# EAGLE design MCUio_v1.0 (EAGLE 9.3.0)
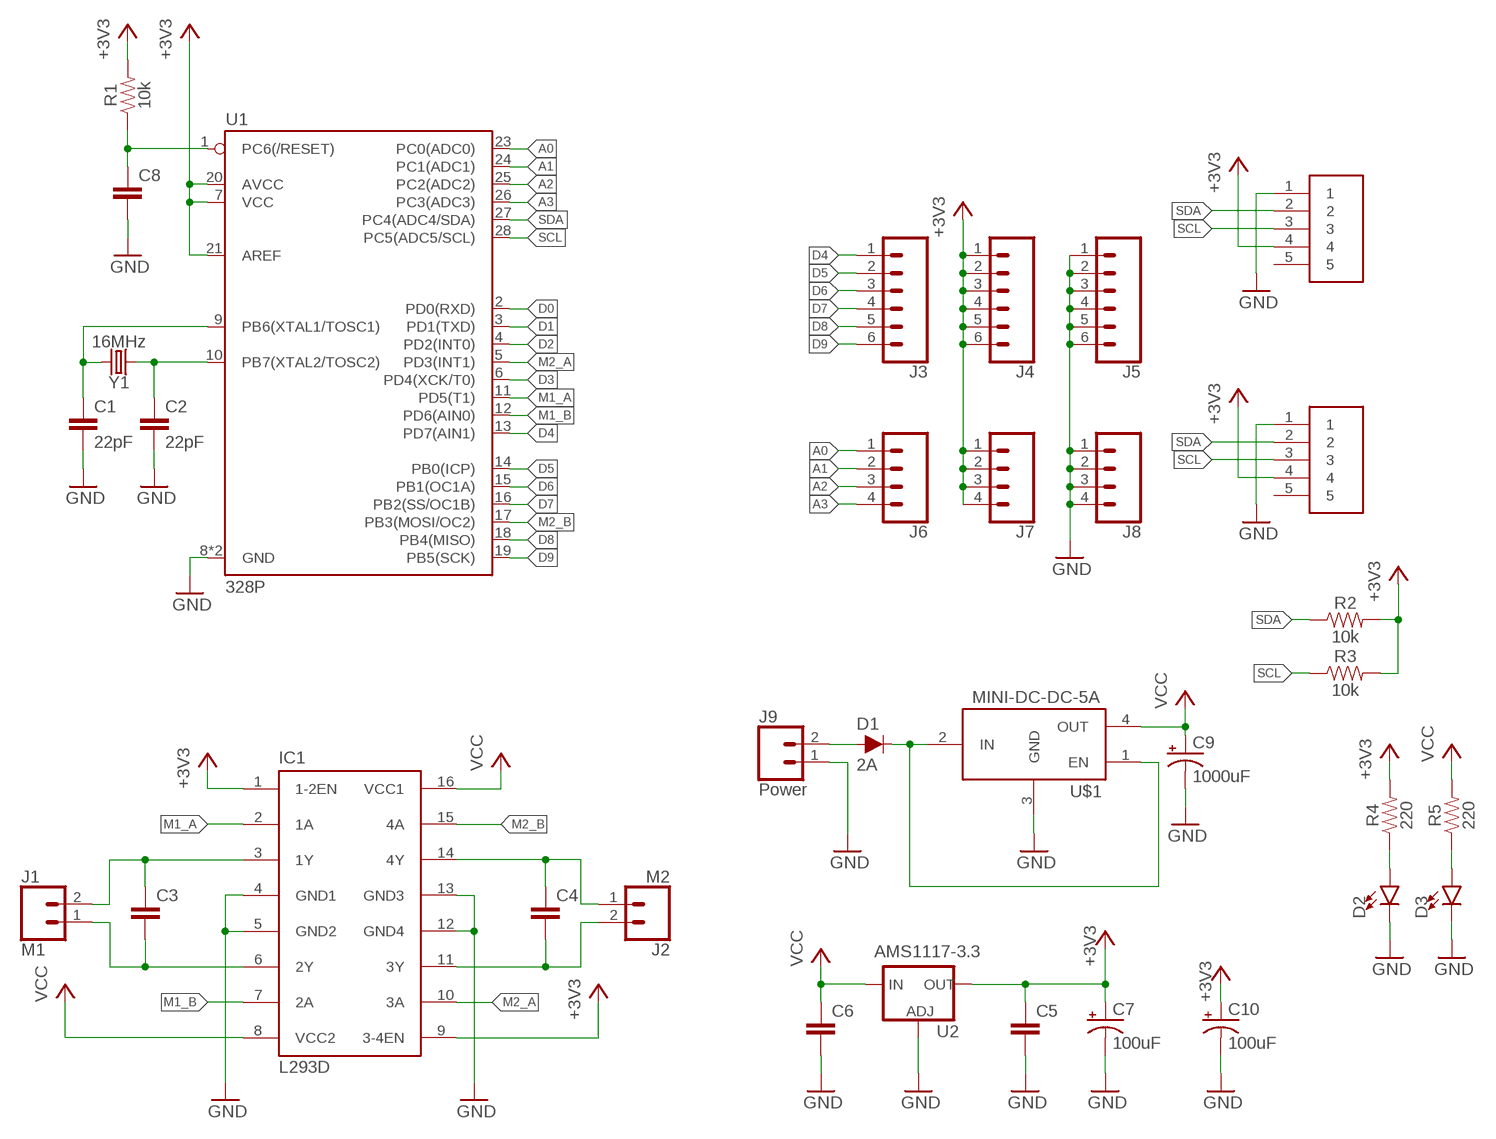
[diagram p0: schematic, sheet 1]

## Parts
C1  22pF  22PF-PTH-2.54MM-200V-5%  [CAP-PTH-2.54]
C2  22pF  22PF-PTH-2.54MM-200V-5%  [CAP-PTH-2.54]
C3  0.1uF  C5/2.5  [C5B2.5]
C4  0.1uF  C5/2.5  [C5B2.5]
C5  0.1uF  C5/2.5  [C5B2.5]
C6  0.1uF  C5/2.5  [C5B2.5]
C7  100uF  100UF-POLAR-RADIAL-2.5MM-25V-20%  [CPOL-RADIAL-2.5MM-6.5MM]
C8  0.1uF  C5/2.5  [C5B2.5]
C9  1000uF  1000UF-RADIAL-5MM-25V-20%  [CPOL-RADIAL-5MM-10MM]
C10  100uF  100UF-POLAR-RADIAL-2.5MM-25V-20%  [CPOL-RADIAL-2.5MM-6.5MM]
D1  2A  DIODE-KIT2  [DIODE-1N4001-KIT]
D2  LED3MM  [LED_3MM]
D3  LED3MM  [LED_3MM]
IC1  L293D  [DIL16]
J1  M1  CONN_025MM  [SCREWTERMINAL-5MM-2]
J2  M2  CONN_025MM  [SCREWTERMINAL-5MM-2]
J3  CONN_06SILK_FEMALE_PTH  [1X06]
J4  CONN_06SILK_FEMALE_PTH  [1X06]
J5  CONN_06SILK_FEMALE_PTH  [1X06]
J6  CONN_04PTH  [1X04]
J7  CONN_04PTH  [1X04]
J8  CONN_04PTH  [1X04]
J9  Power  CONN_025MM  [SCREWTERMINAL-5MM-2]
R1  10k  10KOHM-HORIZ-1/4W-5%  [AXIAL-0.3]
R2  10k  10KOHM-HORIZ-1/4W-5%  [AXIAL-0.3]
R3  10k  10KOHM-HORIZ-1/4W-5%  [AXIAL-0.3]
R4  220  220OHM-0603-1/10W-1%  [0603]
R5  220  220OHM-0603-1/10W-1%  [0603]
U1  328P  ATMEGA328P_PDIP  [DIP28]
U2  AMS1117-3.3  V_REG_LM1117SOT223  [SOT223]
U$1  MINI-DC-DC-5A  [MINI-DC-DC-3A]
U$2  JST5PIN  [JST5PIN]
U$3  JST5PIN  [JST5PIN]
Y1  16MHz  CRYSTAL-16MHZPTH-HC49US  [HC49US]

## Nets
+3V3: C5.1 C7.1(+) C10.1(+) IC1.1(1-2EN) IC1.9(3-4EN) J4.1 J4.2 J4.3 J4.4 J4.5 J4.6 J7.1 J7.2 J7.3 J7.4 R1.P$2 R2.P$2 R3.P$2 R4.2 U1.7(VCC) U1.20(AVCC) U1.21(AREF) U2.2(OUT) U2.4(OUT) U$2.4 U$3.4
A0: J6.1 U1.23(PC0(ADC0))
A1: J6.2 U1.24(PC1(ADC1))
A2: J6.3 U1.25(PC2(ADC2))
A3: J6.4 U1.26(PC3(ADC3))
D0: U1.2(PD0(RXD))
D1: U1.3(PD1(TXD))
D2: U1.4(PD2(INT0))
D3: U1.6(PD4(XCK/T0))
D4: J3.1 U1.13(PD7(AIN1))
D5: J3.2 U1.14(PB0(ICP))
D6: J3.3 U1.15(PB1(OC1A))
D7: J3.4 U1.16(PB2(SS/OC1B))
D8: J3.5 U1.18(PB4(MISO))
D9: J3.6 U1.19(PB5(SCK))
GND: C1.2 C2.2 C5.2 C6.2 C7.2(-) C8.2 C9.- C10.2(-) D2.K(C) D3.K(C) IC1.4(GND1) IC1.5(GND2) IC1.12(GND4) IC1.13(GND3) J5.1 J5.2 J5.3 J5.4 J5.5 J5.6 J8.1 J8.2 J8.3 J8.4 J9.1 U1.8(GND) U1.22(GND) U2.1(ADJ) U$1.3(GND) U$2.1 U$3.1
M1_A: IC1.2(1A) U1.11(PD5(T1))
M1_B: IC1.7(2A) U1.12(PD6(AIN0))
M2_A: IC1.10(3A) U1.5(PD3(INT1))
M2_B: IC1.15(4A) U1.17(PB3(MOSI/OC2))
N$1: C1.1 U1.9(PB6(XTAL1/TOSC1)) Y1.2
N$2: C2.1 U1.10(PB7(XTAL2/TOSC2)) Y1.1
N$3: C8.1 R1.P$1 U1.1(PC6(/RESET))
N$4: D1.A J9.2
N$5: D1.C U$1.1(EN) U$1.2(IN)
N$6: D2.A R4.1
N$7: D3.A R5.1
N$10: C3.1 IC1.3(1Y) J1.2
N$11: C3.2 IC1.6(2Y) J1.1
N$12: C4.1 IC1.14(4Y) J2.1
N$13: C4.2 IC1.11(3Y) J2.2
SCL: R3.P$1 U1.28(PC5(ADC5/SCL)) U$2.3 U$3.3
SDA: R2.P$1 U1.27(PC4(ADC4/SDA)) U$2.2 U$3.2
VCC: C6.1 C9.+ IC1.8(VCC2) IC1.16(VCC1) R5.2 U2.3(IN) U$1.4(OUT)
Unconnected: U$2.5 U$3.5

## Library data of the parts
C1 C2 = SparkFun-Capacitors:22PF: 22pF ceramic capacitors A capacitor is a passive two-terminal electrical component used to store electrical energy temporarily in an electric field.; PROD_ID: CAP-09128
C3-C6 C8 = capacitor-wima:C: CAPACITOR naming: grid - package width
C7 C10 = SparkFun-Capacitors:100UF-POLAR: 100µF polarized capacitors A capacitor is a passive two-terminal electrical component used to store electrical energy temporarily in an electric field.; PROD_ID: CAP-08439
C9 = SparkFun-Capacitors:1000UF: 1,000µF/1mF ceramic capacitors A capacitor is a passive two-terminal electrical component used to store electrical energy temporarily in an electric field. CAP-08070; PROD_ID: CAP-09538; VALUE: 1mF
D1 = SparkFun-DiscreteSemi:DIODE: Diode These are standard reverse protection diodes and small signal diodes. SparkFun Products: SparkFun SparkPunk Sound Kit <https://www.sparkfun.com/products/11177> SparkFun ESP8266 Thing <https://www.sparkfun.com/products/13231>; PROD_ID: DIO-09176; VALUE: 1A/50V/1.1V
D2 D3 = SparkFun-LED:LED: LED (Generic) Standard schematic elements and footprints for 5mm, 3mm, 1206, and 0603 sized LEDs. Generic LEDs with no color specified.; PROD_ID: DIO-08794
IC1 = st-microelectronics:L293D: PUSH-PULL 4 CHANNEL DRIVER; MPN: L293D; OC_FARNELL: 9589619; OC_NEWARK: 56P8249
J1 J2 J9 = SparkFun-Connectors:CONN_02: Multi connection point. Often used as Generic Header-pin footprint for 0.1 inch spaced/style header connections On any of the 0.1 inch spaced packages, you can populate with these: Break Away Headers - Straight <https://www.sparkfun.com/products/116> (PRT-00116) Break Away Male Headers - Right Angle <https://www.sparkfun.com/products/553> (PRT-00553) Female Headers <https://www.sparkfun.com/products/115> (PRT-00115) Break Away Headers - Machine Pin <https://www.sparkfun.com/products/117> (PRT-00117) Break Away Female Headers - Swiss Machine Pin <https://www.sparkfun.com/products/743> (PRT-00743) For SCREWTERMINALS and SPRING TERMINALS visit here: Screw Terimnals on SparkFun.com <https://www.sparkfun.com/search/results?term=Screw+Terminals> (5mm/3.5mm/2.54mm spacing) This device is also useful as a general connection point to wire up your design to another part of your project. Our various solder wires solder well into these plated through hole pads. Hook-Up Wire - Assortment (Stranded, 22 AWG) <https://www.sparkfun.com/products/11375> (PRT-11375) Hook-Up Wire - Assortment (Solid Core, 22 AWG) <https://www.sparkfun.com/products/11367> (PRT-11367) View the entire wire category on our website here <https://www.sparkfun.com/categories/141> Special notes: Molex polarized connector foot print use with: PRT-08233 with associated crimp pins and housings. 2.54_SCREWTERM for use with PRT-10571. 3.5mm Screw Terminal footprints for PRT-08084 5mm Screw Terminal footprints for use with PRT-08432; SF_SKU: PRT-08432
J3-J5 = SparkFun-Connectors:CONN_06: Multi connection point. Often used as Generic Header-pin footprint for 0.1 inch spaced/style header connections On any of the 0.1 inch spaced packages, you can populate with these: Break Away Headers - Straight <https://www.sparkfun.com/products/116> (PRT-00116) Break Away Male Headers - Right Angle <https://www.sparkfun.com/products/553> (PRT-00553) Female Headers <https://www.sparkfun.com/products/115> (PRT-00115) Break Away Headers - Machine Pin <https://www.sparkfun.com/products/117> (PRT-00117) Break Away Female Headers - Swiss Machine Pin <https://www.sparkfun.com/products/743> (PRT-00743) Arduino Stackable Header - 6 Pin <https://www.sparkfun.com/products/9280> (PRT-09280) For SCREWTERMINALS and SPRING TERMINALS visit here: Screw Terimnals on SparkFun.com <https://www.sparkfun.com/search/results?term=Screw+Terminals> (5mm/3.5mm/2.54mm spacing) This device is also useful as a general connection point to wire up your design to another part of your project. Our various solder wires solder well into these plated through hole pads. Hook-Up Wire - Assortment (Stranded, 22 AWG) <https://www.sparkfun.com/products/11375> (PRT-11375) Hook-Up Wire - Assortment (Solid Core, 22 AWG) <https://www.sparkfun.com/products/11367> (PRT-11367) View the entire wire category on our website here <https://www.sparkfun.com/categories/141>; PROD_ID: CONN-08437
J6-J8 = SparkFun-Connectors:CONN_04: Multi connection point. Often used as Generic Header-pin footprint for 0.1 inch spaced/style header connections On any of the 0.1 inch spaced packages, you can populate with these: Break Away Headers - Straight <https://www.sparkfun.com/products/116> (PRT-00116) Break Away Male Headers - Right Angle <https://www.sparkfun.com/products/553> (PRT-00553) Female Headers <https://www.sparkfun.com/products/115> (PRT-00115) Break Away Headers - Machine Pin <https://www.sparkfun.com/products/117> (PRT-00117) Break Away Female Headers - Swiss Machine Pin <https://www.sparkfun.com/products/743> (PRT-00743) For SCREWTERMINALS and SPRING TERMINALS visit here: Screw Terimnals on SparkFun.com <https://www.sparkfun.com/search/results?term=Screw+Terminals> (5mm/3.5mm/2.54mm spacing) This device is also useful as a general connection point to wire up your design to another part of your project. Our various solder wires solder well into these plated through hole pads. Hook-Up Wire - Assortment (Stranded, 22 AWG) <https://www.sparkfun.com/products/11375> (PRT-11375) Hook-Up Wire - Assortment (Solid Core, 22 AWG) <https://www.sparkfun.com/products/11367> (PRT-11367) View the entire wire category on our website here <https://www.sparkfun.com/categories/141> Special notes: Molex polarized connector foot print use with SKU : PRT-08231 with associated crimp pins and housings. 1MM SMD Version SKU: PRT-10208; PROD_ID: CONN-09696
R1-R3 = SparkFun-Resistors:10KOHM: 10kΩ resistor A resistor is a passive two-terminal electrical component that implements electrical resistance as a circuit element. Resistors act to reduce current flow, and, at the same time, act to lower voltage levels within circuits. - Wikipedia; PROD_ID: RES-09435
R4 R5 = SparkFun-Resistors:220OHM: 220Ω resistor A resistor is a passive two-terminal electrical component that implements electrical resistance as a circuit element. Resistors act to reduce current flow, and, at the same time, act to lower voltage levels within circuits. - Wikipedia; PROD_ID: RES-07861
U1 = SparkFun-IC-Microcontroller:ATMEGA328P_PDIP: Atmel 328P Through hole ATMEGA328P uC used in the Arduino 32kb flash, 1k EEPROM, 2k SRAM Datasheet <http://www.sparkfun.com/datasheets/Components/SMD/ATMega328.pdf> SparkFun Products Storefront component: AVR 28 Pin 20MHz 32K 6A/D - ATMega328P <https://www.sparkfun.com/products/9061> (COM-09061) SparkFun Simon Says - Through-Hole Soldering Kit <https://www.sparkfun.com/products/10547> (KIT-10547) SparkFun Learn to Solder - Simon Says <https://www.sparkfun.com/products/13708> (KIT-13708) SparkFun BigTime Watch Kit <https://www.sparkfun.com/products/11734> (KIT-11734) SparkFun ClockIt <https://www.sparkfun.com/products/10930> (KIT-10930) SparkFun Serial Enabled LCD Kit <https://www.sparkfun.com/products/10097> (LCD-10097) SparkFun Simon Tilts - Through Hole Soldering Kit <https://www.sparkfun.com/products/12634> (KIT-12634) SparkFun Frequency Counter Kit <https://www.sparkfun.com/products/10140> (KIT-10140) FabFM Radio Kit <https://www.sparkfun.com/products/11043> (KIT-11043) SparkFun Binary Blaster Kit <https://www.sparkfun.com/products/12037> (KIT-12037) SparkFun Metro-Gnome <https://www.sparkfun.com/products/9236> (KIT-09236) ATmega328 with Arduino Optiboot (Uno) <https://www.sparkfun.com/products/10524> (DEV-10524); PROD_ID: IC-09136
U2 = SparkFun-IC-Power:V_REG_LM1117: Voltage Regulator LM1117 Standard adjustable voltage regulator but in SMD form. Spark Fun Electronics SKU : COM-00595; PROD_ID: VREG-08170
U$1 = mini-dc-dc-3a:MINI-DC-DC-5A
U$2 U$3 = JST5PIN:JST5PIN
Y1 = SparkFun-Clocks:CRYSTAL-16MHZ: 16MHz Crystal Digikey Example <http://www.digikey.com/product-search/en?keywords=535-9122-1-ND> Frequency: 16MHz Frequency Stability: ±50ppm Frequency Tolerance: ±20ppm Load Capacitance: 18pF SparkFun Products: Pro Micro -5V/16MHz <https://www.sparkfun.com/products/12640> SparkFun Serial Enabled LCD Kit <https://www.sparkfun.com/products/10097>; PROD_ID: XTAL-08181; SF_ID: COM-00536

## Board
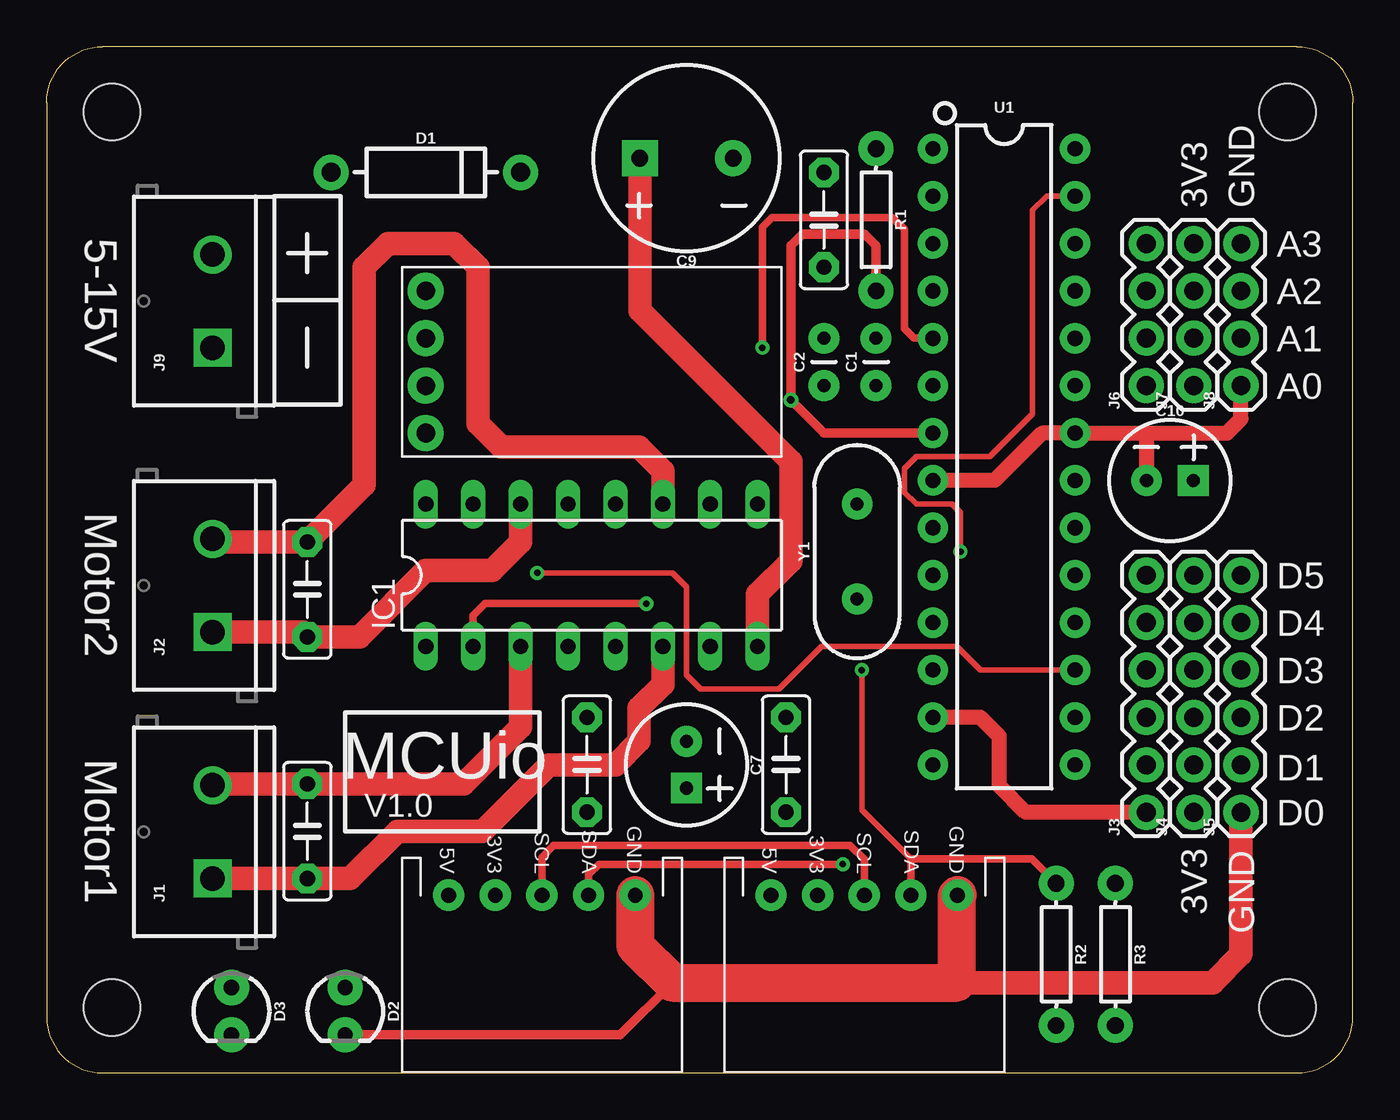
[diagram p1: board, top side]
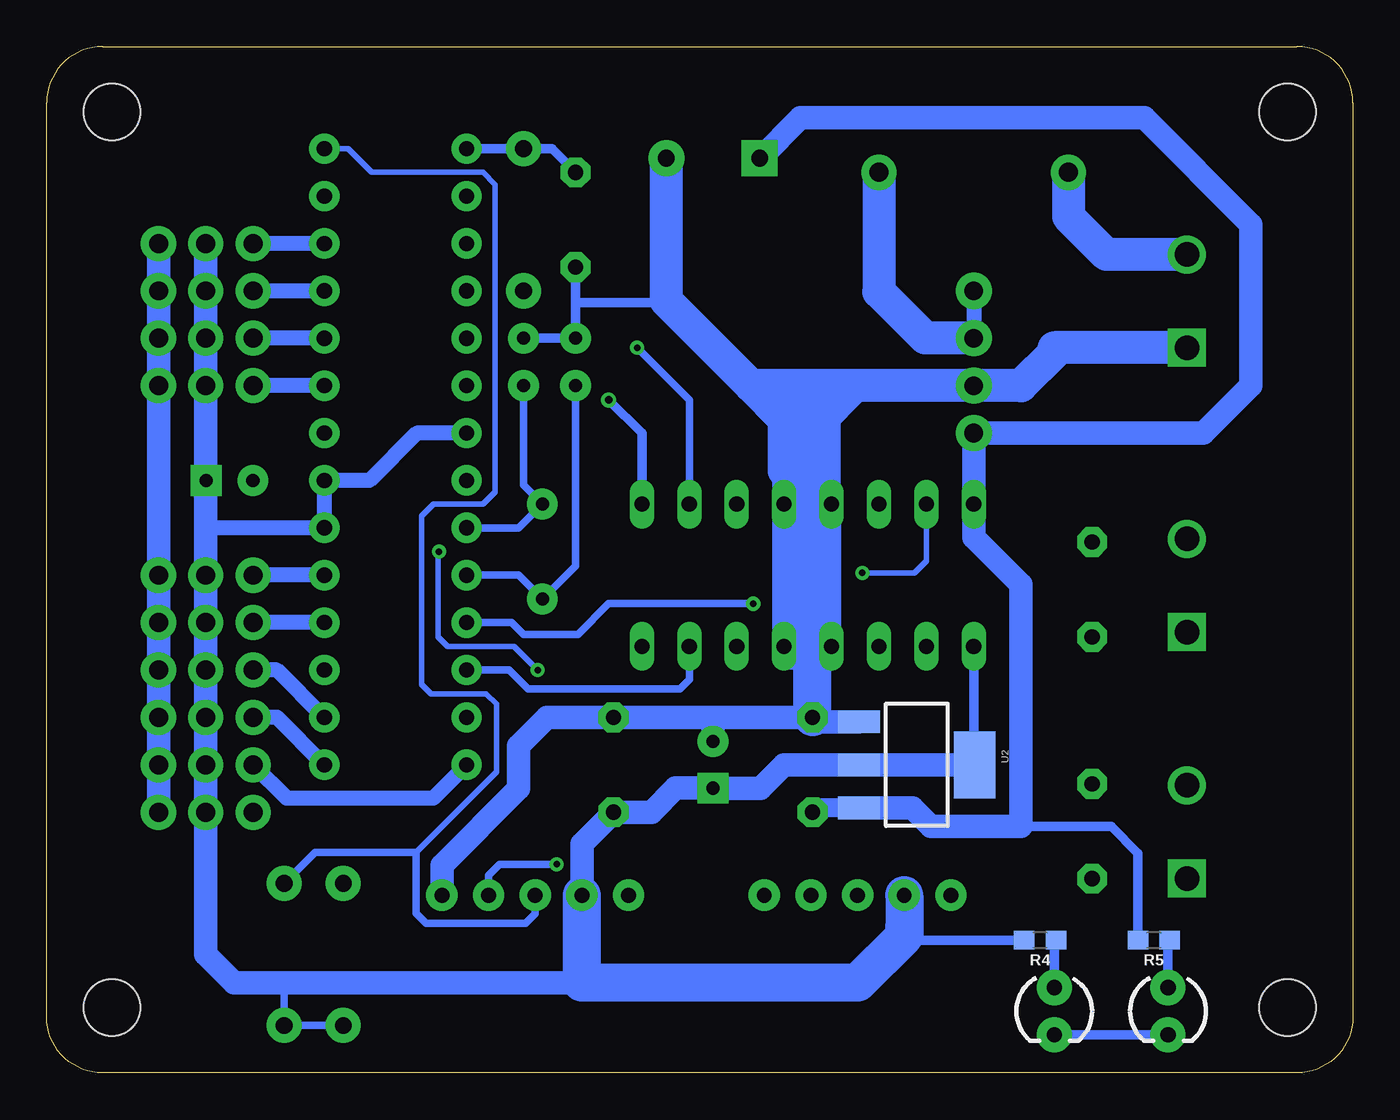
[diagram p2: board, bottom side, seen from below]

Size 70 x 55 mm. Coordinates in mm from the lower left corner, seen from the top.
Outline: 3,0 67,0 arc90 70,3 70,52 arc90 67,55 3,55 arc90 0,52 0,3 arc90 3,0
Copper layers (1*16): Top 0.035mm / dielectric 1.5mm / Bottom 0.035mm
Design rules "default *": minimum track width 6mil, minimum drill 0.35mm, track to track 6mil, track to pad 6mil, pad to pad 6mil, via to via 6mil, smd to smd 6mil, copper to edge 40mil, drill to drill 6mil, minimum pad ring 10mil, minimum via ring 8mil, stop-mask expansion 4mil, vias tented up to drill 20mil, thermal gap 10mil
Holes 3.05 mm at 3.5,3.5 3.5,51.5 66.5,51.5 66.5,3.5

### Footprints (pad centres in the part's own frame; a part is rotated, then mirrored left to right if it is on the bottom)
CAP-PTH-2.54 = drill 0.7 pad 1.651: 1 -1.27,0; 2 1.27,0
C5B2.5 = drill 0.813 pad 1.6 octagon: 1 -2.54,0; 2 2.54,0
CPOL-RADIAL-2.5MM-6.5MM = drill 0.7 pad 1.651 square: 1 1.25,0 | drill 0.7 pad 1.651: 2 -1.25,0
CPOL-RADIAL-5MM-10MM = drill 0.9 pad 1.93 square: + 2.5,0 | drill 0.9 pad 1.93: - -2.5,0
DIODE-1N4001-KIT = drill 1.016 pad 1.88: A -5.08,0; C 5.08,0
LED_3MM = drill 0.813 pad 1.88: A -1.27,0; K 1.27,0
DIL16 = drill 0.813 long: 1 -8.89,-3.81; 2 -6.35,-3.81; 3 -3.81,-3.81; 4 -1.27,-3.81; 5 1.27,-3.81; 6 3.81,-3.81; 7 6.35,-3.81; 8 8.89,-3.81; 9 8.89,3.81; 10 6.35,3.81; 11 3.81,3.81; 12 1.27,3.81; 13 -1.27,3.81; 14 -3.81,3.81; 15 -6.35,3.81; 16 -8.89,3.81
SCREWTERMINAL-5MM-2 = drill 1.3 pad 2.032 square: 1 0,0 | drill 1.3 pad 2.032: 2 5,0
1X06 = drill 1.016 pad 1.88: 1 0,0; 2 2.54,0; 3 5.08,0; 4 7.62,0; 5 10.16,0; 6 12.7,0
1X04 = drill 1.016 pad 1.88: 1 0,0; 2 2.54,0; 3 5.08,0; 4 7.62,0
AXIAL-0.3 = drill 0.9 pad 1.88: P$1 -3.81,0; P$2 3.81,0
0603 = smd 1.1 x 1: 1 -0.85,0; 2 0.85,0
DIP28 = drill 0.813 pad 1.626: 1 -16.51,-3.81; 2 -13.97,-3.81; 3 -11.43,-3.81; 4 -8.89,-3.81; 5 -6.35,-3.81; 6 -3.81,-3.81; 7 -1.27,-3.81; 8 1.27,-3.81; 9 3.81,-3.81; 10 6.35,-3.81; 11 8.89,-3.81; 12 11.43,-3.81; 13 13.97,-3.81; 14 16.51,-3.81; 15 16.51,3.81; 16 13.97,3.81; 17 11.43,3.81; 18 8.89,3.81; 19 6.35,3.81; 20 3.81,3.81; 21 1.27,3.81; 22 -1.27,3.81; 23 -3.81,3.81; 24 -6.35,3.81; 25 -8.89,3.81; 26 -11.43,3.81; 27 -13.97,3.81; 28 -16.51,3.81
SOT223 = smd 1.219 x 2.235: 1 -2.311,-3.099; 2 0,-3.099; 3 2.311,-3.099 | smd 3.6 x 2.2: 4 0,3.099
MINI-DC-DC-3A = drill 1 pad 1.93: 1 -3.81,-8.89; 2 -1.27,-8.89; 3 1.27,-8.89; 4 3.81,-8.89
JST5PIN = drill 0.8 pad 1.676: 1 0,5; 2 0,2.5; 3 0,0; 4 0,-2.5; 5 0,-5
HC49US = drill 0.7 pad 1.651: 1 -2.54,0; 2 2.54,0

### Placement (x,y rotation side)
C1  44.45,38.1 90 top
C2  41.66,38.1 90 top
C3  13.97,12.95 270 top
C4  13.97,25.91 90 top
C5  39.62,16.51 90 top
C6  28.96,16.51 90 top
C7  34.29,16.51 270 top
C8  41.66,45.72 270 top
C9  34.29,49.02 180 top
C10  60.2,31.75 0 top
D1  20.32,48.26 0 top
D2  16,3.3 270 top
D3  9.91,3.3 270 top
IC1  29.21,26.67 0 top
J1  8.89,10.41 90 top
J2  8.89,23.62 90 top
J3  58.93,13.97 90 top
J4  61.47,13.97 90 top
J5  64.01,13.97 90 top
J6  58.93,36.83 90 top
J7  61.47,36.83 90 top
J8  64.01,36.83 90 top
J9  8.89,38.86 90 top
R1  44.45,45.72 270 top
R2  54.1,6.35 270 top
R3  57.28,6.35 270 top
R4  16.76,7.11 180 bottom
R5  10.67,7.11 180 bottom
U1  51.31,33.02 270 top
U2  23.37,16.51 270 bottom
U$1  29.21,38.1 270 top
U$2  43.81,9.53 270 top
U$3  26.54,9.53 270 top
Y1  43.43,27.94 90 top

### Tracks (layer width: path | path; a pad name or v marks a point on that pad's centre or on a via)
+3V3  (via drill 0.4)
  Top 0.508: U1.7 41.66,34.29 v39.88,36.07 39.88,44.32 40.51,44.96 43.81,44.96 44.45,44.32 R1.P$2
  Bottom 0.406: R2.P$2 R3.P$2 57.28,4.7 57.15,4.83
  Bottom 0.508: IC1.1 20.32,16.56 U2.4 | IC1.9 38.1,34.29 v39.88,36.07 | 24.04,6.82 23.75,7.11 23.32,7.11 | R4.2 23.32,7.11 | 23.32,7.11 24.04,7.83
  Bottom 0.813: U1.7 50.16,34.29 52.7,31.75 U1.21 U1.20 61.47,29.21 | C10.1 61.47,31.73 61.47,31.5
  Bottom 1.016: 34.27,15.24 C7.1
  Bottom 1.27: U$2.4 41.31,12.28 C5.1 37.59,13.97 36.3,15.26 C7.1 | 34.27,15.24 31.75,15.24 30.48,16.51 U2.2 U2.4 | J7.4 J7.3 J7.2 J7.1 61.47,31.5 61.47,29.21 J4.6 J4.5 J4.4 J4.3 J4.2 J4.1 61.47,6.35 59.94,4.83 57.15,4.83 41.31,4.83
  Bottom 2.032: U$3.4 24.04,7.83 24.04,7.33 26.54,4.83 41.31,4.83 U$2.4
A0
  Bottom 0.813: U1.23 J6.1
A1
  Bottom 0.813: U1.24 J6.2
A2
  Bottom 0.813: U1.25 J6.3
A3
  Bottom 0.813: U1.26 J6.4
D4
  Top 0.813: J3.1 52.45,13.97 51.05,15.37 51.05,18.03 50.04,19.05 U1.13
D5
  Bottom 0.813: J3.2 57.15,14.73 49.28,14.73 U1.14
D6
  Bottom 0.813: U1.15 57.66,19.05 J3.3
D7
  Bottom 0.813: U1.16 57.66,21.59 J3.4
D8
  Bottom 0.813: U1.18 J3.5
D9
  Bottom 0.813: U1.19 J3.6
GND
  Top 0.508: D2.K 30.73,2.03 33.53,4.83
  Top 0.813: 59.05,34.29 U1.22 53.34,34.29 50.8,31.75 U1.8 | 59.05,34.29 63.25,34.29 64.01,35.05 J8.1 | C10.2 58.95,34.18 59.05,34.29
  Top 1.27: 48.77,4.83 62.48,4.83 64.01,6.35 J5.1
  Top 2.032: U$3.1 31.54,6.81 33.53,4.83 48.77,4.83 48.77,9.48 U$2.1
  Bottom 0.508: C8.2 41.66,41.27 | 41.66,41.27 C2.2 C1.2 | 36.79,41.36 36.88,41.27 41.66,41.27 | D3.K D2.K
  Bottom 1.016: 28.7,36.83 29.72,35.81 | 29.72,35.81 30.48,35.05 | 26.67,36.83 27.94,36.83 | 27.94,36.83 28.7,36.83 | IC1.13 27.94,36.83 | 28.7,30.48 IC1.13 | 28.7,36.83 28.7,34.8 28.7,30.48 | 28.7,30.48 29.46,30.48 | 29.46,30.48 IC1.12 | 29.46,30.48 29.46,35.56 29.72,35.81 | IC1.13 IC1.4 | IC1.4 29.21,22.86 IC1.5 30.48,22.1 27.94,22.1 IC1.4 | 28.73,18.82 C6.2
  Bottom 1.27: 30.48,32.26 IC1.12 IC1.5 | 34.29,19.05 C6.2 arc-90 28.73,18.82 U2.1 | 34.29,19.05 C5.2 43.18,19.05 44.7,17.53 44.7,15.24 48.81,11.13 U$2.1 | C7.2 34.29,19.05 | J8.4 J8.3 J8.2 J8.1 J5.6 J5.5 J5.4 J5.3 J5.2 J5.1
  Bottom 1.778: 28.7,36.83 U$1.3 17.78,36.83 16,38.61 16,38.86 J9.1 | 28.7,36.83 30.48,35.05 | 30.48,35.05 30.48,32.26 | 28.7,36.83 32.26,36.83 | 32.26,36.83 36.79,41.36 C9.- | 30.48,35.05 32.26,36.83 | 28.7,34.8 26.67,36.83
  Bottom 2.032: C6.2 28.96,22.61 29.21,22.86
  Bottom 2.54: 29.46,30.48 29.46,23.11 29.21,22.86
M1_A  (via drill 0.35)
  Top 0.406: v32.13,25.15 23.5,25.15 22.86,24.51 IC1.2
  Bottom 0.406: U1.11 45.09,24.13 44.45,23.5 41.53,23.5 39.88,25.15 v32.13,25.15
M1_B
  Bottom 0.406: U1.12 45.21,21.59 44.2,20.57 36.07,20.57 35.56,21.08 IC1.7
M2_A  (via drill 0.35)
  Top 0.406: U1.5 46.48,39.37 45.97,39.88 45.97,45.21 45.34,45.85 38.86,45.85 38.35,45.34 v38.35,38.86
  Bottom 0.406: v38.35,38.86 35.56,36.07 IC1.10
M2_B  (via drill 0.35)
  Top 0.305: U1.17 50.04,21.59 48.77,22.86 41.53,22.86 39.24,20.57 35.05,20.57 34.29,21.34 34.29,26.04 33.53,26.8 v26.29,26.8
  Bottom 0.305: v26.29,26.8 23.5,26.8 22.86,27.43 IC1.15
N$1
  Bottom 0.406: U1.9 44.7,29.21 Y1.2 44.45,31.5 C1.1
N$2
  Bottom 0.406: U1.10 44.7,26.67 Y1.1 41.66,27.18 C2.1
N$3
  Bottom 0.508: C8.1 42.93,49.53 R1.P$1 U1.1
N$4
  Bottom 1.778: J9.2 13.21,43.86 15.24,45.89 D1.A
N$5
  Bottom 0.813: U$1.1 20.32,39.4 20.34,39.4
  Bottom 1.778: U$1.2 20.34,39.4 22.93,39.4 25.4,41.87 D1.C
N$6
  Bottom 0.508: D2.A 16,7.02 R4.1
N$7
  Bottom 0.508: D3.A 9.91,7.02 R5.1
N$10
  Top 1.27: J1.2 8.97,15.49 C3.1 22.35,15.49 25.4,18.54 IC1.3
N$11
  Top 1.27: J1.1 C3.2 16.26,10.41 18.8,12.95 23.37,12.95 26.92,16.51 30.48,16.51 31.75,17.78 31.75,19.56 33.02,20.83 IC1.6
N$12
  Top 1.27: J2.1 13.72,23.62 C4.1 16.76,23.37 20.32,26.92 23.88,26.92 25.4,28.45 IC1.14
N$13
  Top 1.27: J2.2 9.06,28.45 C4.2 17.02,31.5 17.02,43.18 18.29,44.45 21.84,44.45 23.11,43.18 23.11,34.8 24.38,33.53 31.75,33.53 33.02,32.26 IC1.11
SCL
  Top 0.406: U$3.3 26.54,11.56 27.18,12.19 43.05,12.19 43.81,11.43 U$2.3
  Bottom 0.305: U1.28 53.85,49.53 52.58,48.26 46.61,48.26 45.96,47.61 45.96,31.13 46.61,30.48 49.28,30.48 49.91,29.84 49.91,20.83 49.4,20.32 46.44,20.32 45.9,19.78 45.9,16.14 50.21,11.82
  Bottom 0.406: U$2.3 43.81,8.51 44.32,8 49.67,8 50.21,8.54 50.21,11.82 55.61,11.82 R3.P$1
SDA  (via drill 0.35)
  Top 0.305: v43.69,21.59 43.69,14.1 46.31,11.47 | v48.97,27.94 48.97,30.02 48.51,30.48 46.61,30.48 45.97,31.11 45.97,32.38 46.61,33.02 50.55,33.02 52.83,35.31 52.83,46.23 53.59,46.99 U1.27
  Top 0.406: v42.67,11.18 29.59,11.18 29.04,10.63 U$3.2 | R2.P$1 52.79,11.47 46.31,11.47 U$2.2
  Bottom 0.305: v43.69,21.59 44.96,22.86 48.51,22.86 49.02,23.37 49.02,27.94 v48.97,27.94
  Bottom 0.406: v42.67,11.18 45.72,11.18 46.31,10.58 U$2.2
VCC
  Top 1.27: IC1.8 38.1,25.65 39.88,27.43 39.88,32.77 31.79,40.85 C9.+
  Bottom 0.508: R5.2 11.52,11.77 12.95,13.21 17.78,13.21
  Bottom 1.016: U2.3 28.73,14.2 C6.1
  Bottom 1.27: U2.3 23.6,14.2 22.61,13.21 17.78,13.21 17.78,26.16 20.32,28.7 IC1.16 U$1.4 8,34.29 5.46,36.83 5.46,45.47 11.18,51.18 29.59,51.18 31.75,49.02 C9.+

### Text on the board
tPlace: 3V3 | GND | A3 | A2 | 5-15V | A1 | A0 | D5 | Motor2 | D4 | D3 | D2 | MCUio | D1 | V1.0 | D0 | Motor1 | 3V3 | GND | 5V | 3V3 | SCL | SDA | GND | 5V | 3V3 | SCL | SDA | GND